# Altium schematic sheet Sheet2.SchDoc: Наименование
size 209 x 297 mm; ApprovedBy: Утвердил; CheckedBy: Проверил; Author: Разработал; CompanyName: Организация; DrawnBy: Н.Контр; Engineer: Т.Контр; SheetNumber: 2; SheetTotal: 6; PageSetup: Record=PageOptions|CenterHorizontal=True|CenterVertical=True|PrintScale=0.94|XCorrection=1.00|YCorrection=1.00|PrintKind=1|BorderSize=5000000|LeftOffset=0|BottomOffset=0|Orientation=1|PaperLength=1000|PaperWidth=1000|Scale=100|PaperSource=7|PrintQuality=-4|MediaType=1|DitherType=10|PaperKind=A4|PrintScaleMode=1; DecimalNumber: Децимальный номер; HeadOfSector: Нач. сектора; MainDevice: Перв.примен.; Name: Наименование; DocumentName: Sheet1.SCHDOC
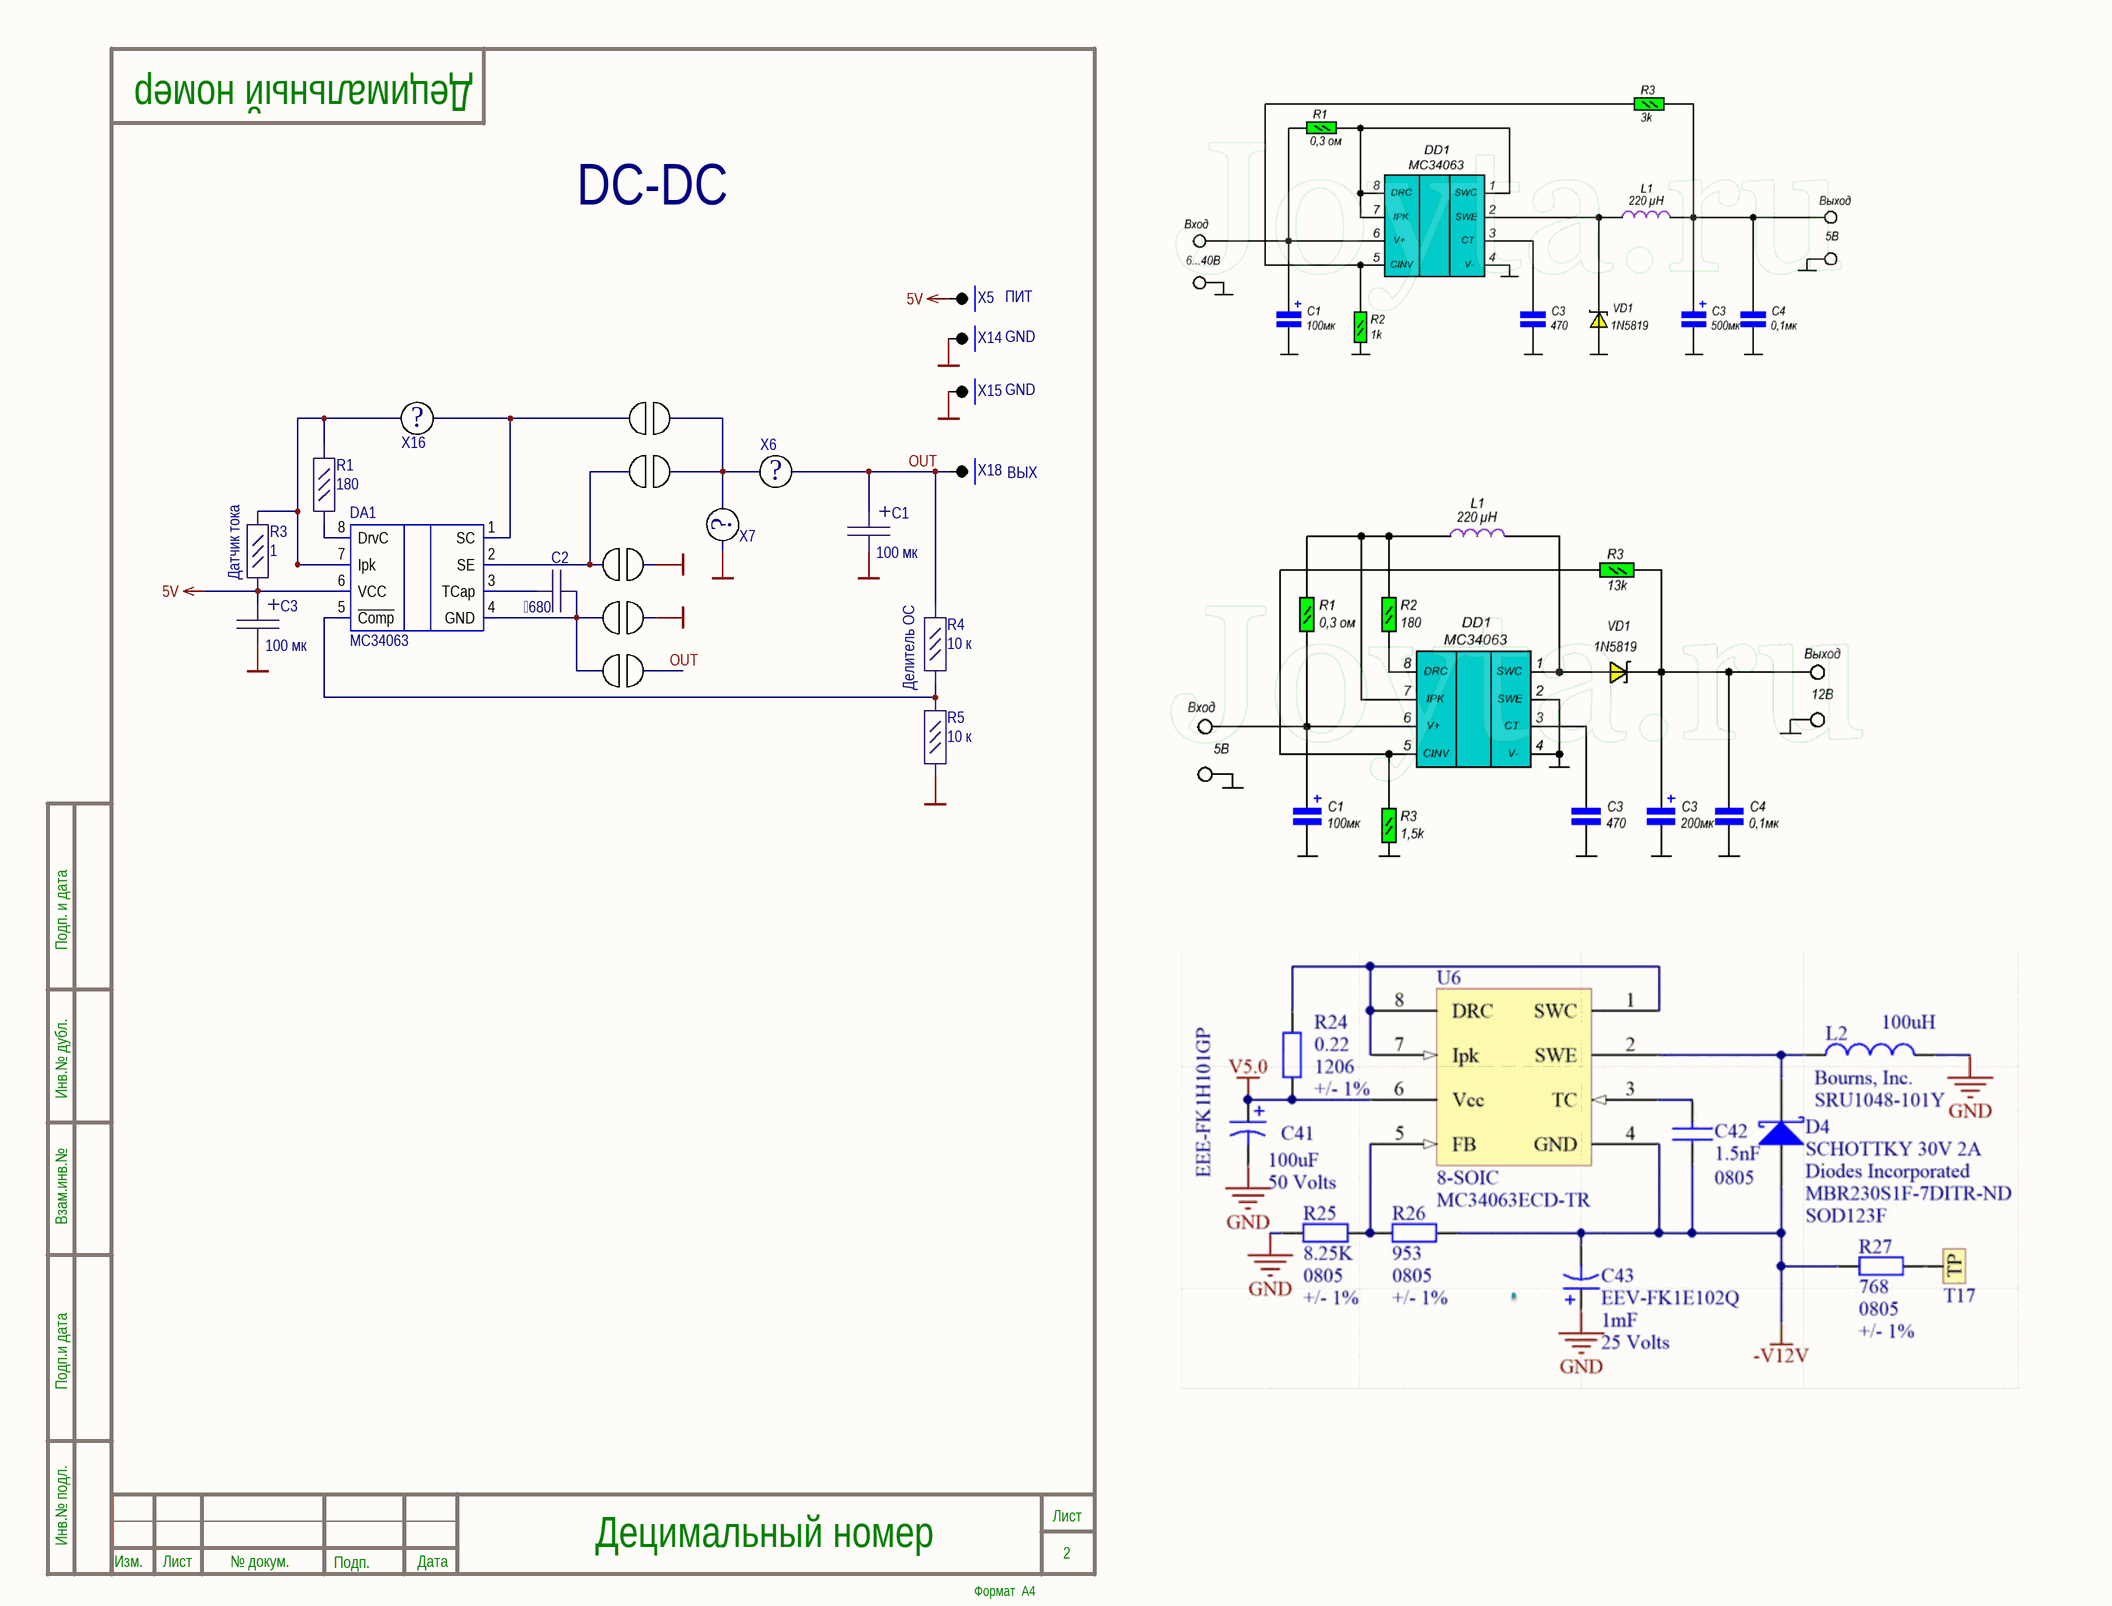
[diagram p0: Sheet2.SchDoc]

## Parts
C1  100 мк  [B_CASE]
C2  680  [C_0603]
C3  100 мк  [B_CASE]
DA1  MC34063  [SO-8]
R1  180  [R_0603]
R3  1  [R_0603]
R4  10 к  [R_0603]
R5  10 к  [R_0603]
X5  КТ  [KT]  (value not drawn)
X6  U-C  [unknown component]  (value not drawn)
X7  U-C  [unknown component]  (value not drawn)
X8  Solder_jumper  [Solder_jumper]  (value not drawn)
X9  Solder_jumper  [Solder_jumper]  (value not drawn)
X10  Solder_jumper  [Solder_jumper]  (value not drawn)
X14  КТ  [KT]  (value not drawn)
X15  КТ  [KT]  (value not drawn)
X16  U-C  [unknown component]  (value not drawn)
X17  Solder_jumper  [Solder_jumper]  (value not drawn)
X18  КТ  [KT]  (value not drawn)
X19  Solder_jumper  [Solder_jumper]  (value not drawn)

## Nets
5V: C3.1 DA1.6(VCC) R3.2 X5.1
GND: C1.2 C3.2 R5.2 X7.1 X9.2 X14.1 X15.1 X19.2
OUT: C1.1 R4.1 X6.2 X10.1 X18.1
NetC2_1: C2.1 DA1.4(GND) X9.1 X10.2
NetC2_2: C2.2 DA1.3(TCap)
NetDA1_1: DA1.1(SC) X16.2 X17.1
NetDA1_2: DA1.2(SE) X8.1 X19.1
NetDA1_5: DA1.5(~{Comp}) R4.2 R5.1
NetDA1_7: DA1.7(Ipk) R1.1 R3.1 X16.1
NetDA1_8: DA1.8(DrvC) R1.2
NetX6_1: X6.1 X7.2 X8.2 X17.2

## Notes on the sheet
- DC-DC
- ПИТ
- GND
- (near X18) ВЫХ
- (near R3) Датчик тока
- Делитель ОС
- Подп. и дата
- Инв.№ дубл.
- Взам.инв.№
- Подп.и дата
- Инв.№ подл.
- Изм.
- Лист
- № докум.
- Подп.
- Дата
- Формат  A4
- (in symbol U-C) ?

## Library data of the parts
C1 C3 = TAJB107K004RNJ: CAP TANT 100UF 10% 4V 1411; Manufacturer: AVX Corporation; Value: 100µF; Part Number: TAJB107K004RNJ; ComponentLink1URL: http://datasheets.avx.com/TAJ.pdf; ComponentLink1Description: Datasheet; Component Type: Tantalum Capacitor
C2 = GRM188R72A104KA35D: CAP CER 0.1UF 100V X7R 0603; Manufacturer: Murata Electronics; Value: 0.1µF; Part Number: GRM188R72A104KA35D; ComponentLink1URL: https://www.murata.com/~/media/webrenewal/support/library/catalog/products/capacitor/mlcc/c02e.ashx?la=en-us; ComponentLink1Description: Datasheet; Component Type: Capasitor
R1 R3 = CR0603-FX-1002ELF: RES SMD 10K OHM 1% 1/10W 0603; Manufacturer: Bourns Inc.; Value: 10 к; Part Number: CR0603-FX-1002ELF; ComponentLink1URL: https://www.bourns.com/pdfs/chpreztr.pdf; ComponentLink1Description: Datasheet; Component Type: Resistor
R4 R5 = CR0603-FX-1002ELF: RES SMD 10K OHM 1% 1/10W 0603; Manufacturer: Bourns Inc.; Part Number: CR0603-FX-1002ELF; Value: 10 к; ComponentLink1URL: https://www.bourns.com/pdfs/chpreztr.pdf; ComponentLink1Description: Datasheet; Component Type: Resistor